# Altium project Ad_Hoc_Node.PrjPCB
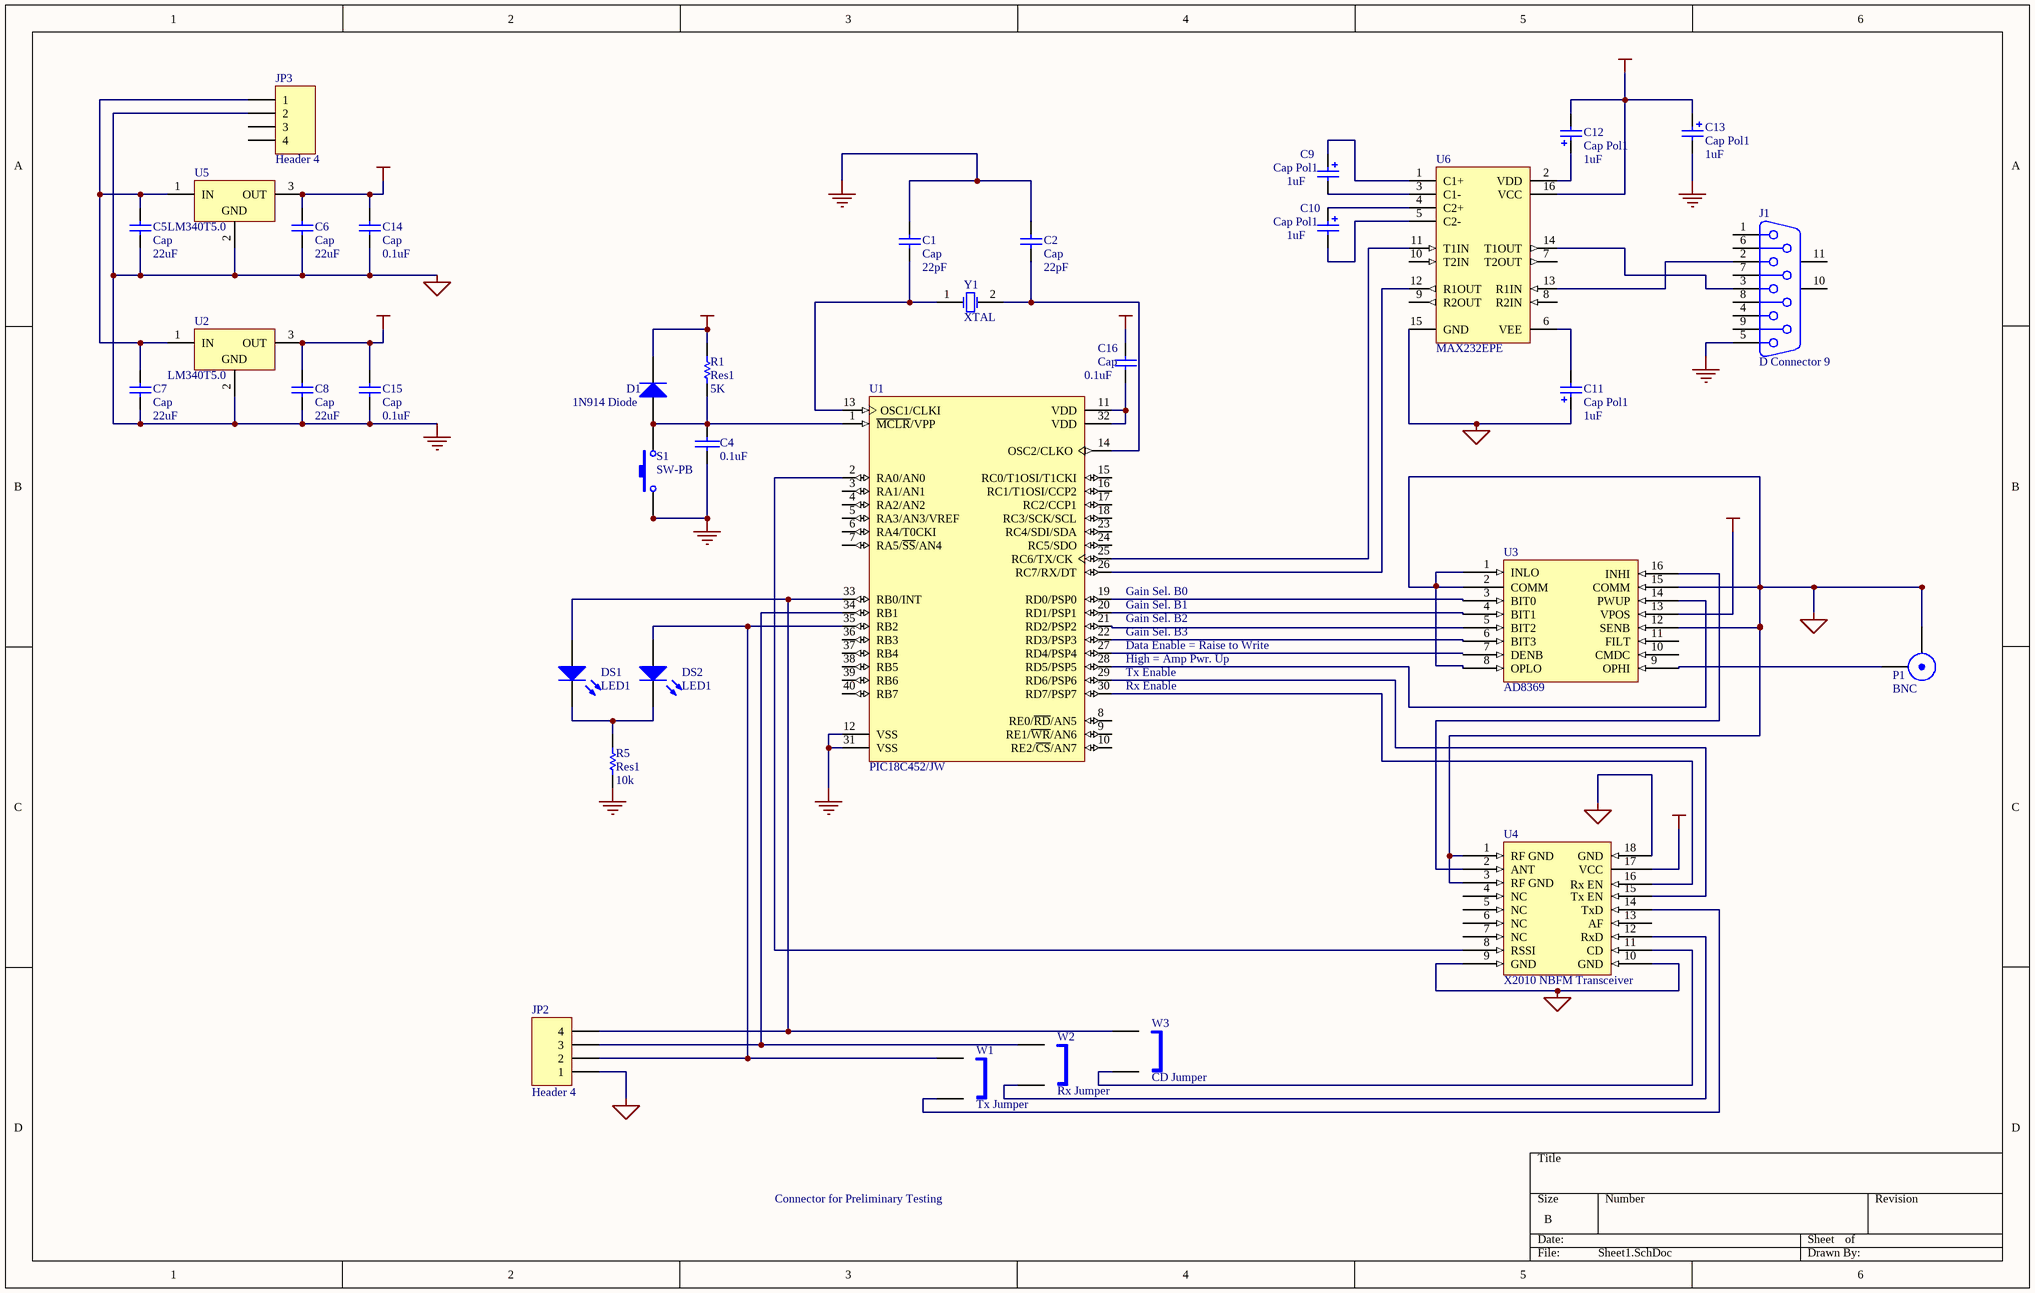
[diagram p0: Sheet1.SchDoc]
2 sheets, 44 parts. Net scope: global (net labels, ports and power ports of the same name join across sheets).
Board files: Ad Hoc Node PCB_A.PcbDoc, TSSOP_Adapt.PcbDoc
Sheets:
  Sheet1.SchDoc
  Sheet2.SchDoc

## Sheet Sheet1.SchDoc
size B

### Parts
(Parts that share a designator on the sheet are numbered #1, #2 ... from top to bottom, then left to right.)
C1  Cap  value 22pF  [5.6mm Ceramic Cap]
C2  Cap  value 22pF  [5.6mm Ceramic Cap]
C4#1  0.1uF  [5mm Tant. Cap]
C5#1  Cap  value 22uF  [2mm Pol. Cap]
C6  Cap  value 22uF  [2mm Pol. Cap]
C7  Cap  value 22uF  [2mm Pol. Cap]
C8  Cap  value 22uF  [2mm Pol. Cap]
C9  Cap Pol1  value 1uF  [2mm Pol. Cap]
C10  Cap Pol1  value 1uF  [2mm Pol. Cap]
C11  Cap Pol1  value 1uF  [2mm Pol. Cap]
C12  Cap Pol1  value 1uF  [2mm Pol. Cap]
C13  Cap Pol1  value 1uF  [2mm Pol. Cap]
C14  Cap  value 0.1uF  [5mm Tant. Cap]
C15  Cap  value 0.1uF  [5mm Tant. Cap]
C16  Cap  value 0.1uF  [5mm Tant. Cap]
D1#1  1N914 Diode  [DIO7.1-3.9X1.9]
DS1  LED1  [LED]
DS2  LED1  [LED]
J1  D Connector 9  [DSUB1.385-2H9]
JP2  Header 4  [4 Way Terminal Block]
JP3  Header 4  [4 Way Terminal Block]
P1  BNC  [PCB BNC Connector - duplicate]
R1#1  Res1  value 5K  [AXIAL-0.3]
R5  Res1  value 10k  [AXIAL-0.3]
S1  SW-PB  [Reset Switch - duplicate]
U1  PIC18C452/JW  [PIC18C452_PLCC - duplicate]
U2#1  LM340T5.0  [SFM-T3/A4.7V]
U3  AD8369  [24 pin DIP socket for TSSOP]
U4  X2010 NBFM Transceiver  [X2010]
U5  LM340T5.0  [SFM-T3/A4.7V]
U6  MAX232EPE  [DIP-16/X1.5]
W1  Tx Jumper  [RAD-0.1]
W2  Rx Jumper  [RAD-0.1]
W3  CD Jumper  [RAD-0.1]
Y1  XTAL  [XTAL]

### Nets
GND: C1.2 C2.2 C4#1.2 C5#1.2 C6.2 C7.2 C8.2 C11.1 C13.2 C14.2 C15.2 J1.5 JP2.1 JP3.2 P1.2(Y) R5.2 S1.1 U1.12(VSS) U1.31(VSS) U2#1.2(GND) U3.12(SENB) U3.15(COMM) U4.1(RF_GND) U4.3(RF_GND) U4.9(GND) U4.10(GND) U4.18(GND) U5.2(GND) U6.15(GND)  [also labelled SGND]
VCC: C6.1 C12.2 C13.1 C14.1 D1#1.2(K) R1#1.2 U3.13(VPOS) U4.17(VCC) U5.3(OUT) U6.16(VCC)
VDD: C8.1 C15.1 C16.1 U2#1.3(OUT)
NetC1_1: C1.1 U1.13(OSC1/CLKI) Y1.1(OSC1)
NetC2_1: C2.1 U1.14(OSC2/CLKO) Y1.2(OSC2)
NetC4#1_1: C4#1.1 D1#1.1(A) R1#1.1 S1.2 U1.1(~{MCLR}/VPP)
NetC5#1_1: C5#1.1 C7.1 JP3.1 U2#1.1(IN) U5.1(IN)
NetC9_1: C9.1 U6.1(C1+)
NetC9_2: C9.2 U6.3(C1-)
NetC10_1: C10.1 U6.4(C2+)
NetC10_2: C10.2 U6.5(C2-)
NetC11_2: C11.2 U6.6(VEE)
NetC12_1: C12.1 U6.2(VDD)
NetC16_2: C16.2 U1.11(VDD) U1.32(VDD)
NetDS1_1: DS1.1(A) JP2.4 U1.33(RB0/INT) W3.1
NetDS1_2: DS1.2(K) DS2.2(K) R5.1
NetDS2_1: DS2.1(A) JP2.2 U1.35(RB2) W1.1
NetJ1_2: J1.2 U6.13(R1IN)
NetJ1_3: J1.3 U6.14(T1OUT)
NetJP2_3: JP2.3 U1.34(RB1) W2.1
NetP1_1: P1.1(X) U3.9(OPHI)
NetU1_2: U1.2(RA0/AN0) U4.8(RSSI)
NetU1_19: U1.19(RD0/PSP0) U3.3(BIT0)
NetU1_20: U1.20(RD1/PSP1) U3.4(BIT1)
NetU1_21: U1.21(RD2/PSP2) U3.5(BIT2)
NetU1_22: U1.22(RD3/PSP3) U3.6(BIT3)
NetU1_25: U1.25(RC6/TX/CK) U6.11(T1IN)
NetU1_26: U1.26(RC7/RX/DT) U6.12(R1OUT)
NetU1_28: U1.28(RD5/PSP5) U3.14(PWUP)
NetU1_29: U1.29(RD6/PSP6) U4.15(Tx_EN)
NetU1_30: U1.30(RD7/PSP7) U4.16(Rx_EN)
NetU3_1: U3.1(INLO) U3.8(OPLO)
NetU3_16: U3.16(INHI) U4.2(ANT)
NetU4_11: U4.11(CD) W3.2
NetU4_12: U4.12(RxD) W2.2
NetU4_14: U4.14(TxD) W1.2

Not connected (* = marked no-connect by the designer): J1 1 4 6 7 8 9 10(MH1) 11(MH2); JP3 3 4; U1 3(RA1/AN1) 4(RA2/AN2) 5(RA3/AN3/VREF) 6(RA4/T0CKI) 7(RA5/~{SS}/AN4) 8(RE0/~{RD}/AN5) 9(RE1/~{WR}/AN6) 10(RE2/~{CS}/AN7) 15(RC0/T1OSI/T1CKI) 16(RC1/T1OSI/CCP2) 17(RC2/CCP1) 18(RC3/SCK/SCL) 23(RC4/SDI/SDA) 24(RC5/SDO) 27(RD4/PSP4) 36(RB3) 37(RB4) 38(RB5) 39(RB6) 40(RB7); U3 2(COMM) 7(DENB) 10(CMDC) 11(FILT); U4 4(NC) 5(NC) 6(NC) 7(NC) 13(AF); U6 7(T2OUT) 8(R2IN) 9(R2OUT) 10(T2IN)

### Notes on the sheet
- (near U1) Gain Sel. B3
- (near U1) Gain Sel. B2
- (near U1) Gain Sel. B1
- (near U1) Gain Sel. B0
- (near U1) Rx Enable
- (near U1) Tx Enable
- (near U1) High = Amp Pwr. Up
- (near U1) Data Enable = Raise to Write
- Connector for Preliminary Testing

### Library data of the parts
C1 C2 C5#1 C6-C8 C14-C16 = Cap: Capacitor; Manufacturer: Generic Components; Class I: Passive; Published: 8-Jun-2000; Revision: July-2002: Re-released for DXP Platform.; Publisher: Altium Limited; Class II: Capacitor
C4#1 = CAP: Capacitor
C9-C13 = Cap Pol1: Polarized Capacitor (Radial); Manufacturer: Generic Components; Class I: Passive; Published: 8-Jun-2000; Revision: July-2002: Re-released for DXP Platform.; Publisher: Altium Limited; Class II: Capacitor
D1#1 = Diode: Default Diode; Manufacturer: Generic Components; Class I: Discrete; Class II: Diode - Switching; Published: 8-Jun-2000; Revision: July-2002: Re-released for DXP Platform.; Publisher: Altium Limited
DS1 DS2 = LED1: Typical RED GaAs LED; Manufacturer: Generic Components; Class I: Optoelectronic; Published: 8-Jun-2000; Revision: July-2002: Re-released for DXP Platform.; Publisher: Altium Limited; Class II: LED
J1 = D Connector 9: Receptacle Assembly, 9 Position, Right Angle; Manufacturer: Generic Components; Package Information: Latest Revision: O; Positions: 9; Published: 15-Jun-2001; Revision: July-2002: Re-released for DXP Platform.; Datasheet: (1-Sep-1999); Package Reference: 788750; Publisher: Altium Limited; Class I: Connector; Orientation: Right Angle; Gender: Receptacle
JP2 JP3 = Header 4: Header, 4-Pin; Manufacturer: Generic Components; Class I: Connector; Revision: July-2002: Re-released for DXP Platform.; Publisher: Altium Limited
P1 = BNC: BNC Elbow Connector; Manufacturer: Generic Components; Class II: RF Coaxial; Revision: July-2002: Re-released for DXP Platform.; Publisher: Altium Limited; Class I: Connector
R1#1 R5 = Res1: Resistor; Manufacturer: Generic Components; Class I: Passive; Published: 8-Jun-2000; Revision: July-2002: Re-released for DXP Platform.; Publisher: Altium Limited; Class II: Resistor
S1 = SW-PB: Switch; Manufacturer: Generic Components; Published: 24-Mar-1999; Revision: July-2002: Re-released for DXP Platform.; Publisher: Altium Limited
U1 = PIC16C74I/JW: EPROM-Based 8-Bit CMOS Microcontroller with A/D Converter; Manufacturer: Microchip; Published: 8-Jun-2000; Revision: July-2002: Re-released for DXP Platform.; Datasheet: Latest Revision: 1997; Package Reference: JW40; Publisher: Altium Limited; Class I: Microcontroller; Class II: 8-bit
U2#1 U5 = LM340T5.0: Series 3-Terminal Positive Regulator; Manufacturer: National Semiconductor; Package Information: Latest Revision: 1995; Class I: Power Management; Class II: Voltage Regulator; Note: Tab is connected to GND; Published: 15-Apr-2002; Datasheet: Latest Revision: Jan-1995; Package Reference: T03B; Publisher: Altium Limited
U3 = AD8369_DIGITAL_CONT_PWR_AMP
U4 = NBFM_TRANSCEIVER
U6 = MAX232EPE: +5V Powered RS-232 Driver/Receiver; Manufacturer: Maxim; Class I: Communication; Class II: Transceiver; Published: 16-Jan-2001; Revision: July-2002: Re-released for DXP Platform.; Datasheet: Latest Revision: Apr-1992; Package Reference: PE16A; Publisher: Altium Limited
W1-W3 = Jumper: Jumper Wire; Manufacturer: Generic Components; Published: 24-Mar-1999; Revision: July-2002: Re-released for DXP Platform.; Publisher: Altium Limited
Y1 = XTAL: Crystal Oscillator; Manufacturer: Generic Components; Published: 8-Jun-2000; Revision: July-2002: Re-released for DXP Platform.; Publisher: Altium Limited; Class I: Oscillator; Class II: Crystal Oscillator

## Sheet Sheet2.SchDoc
size B
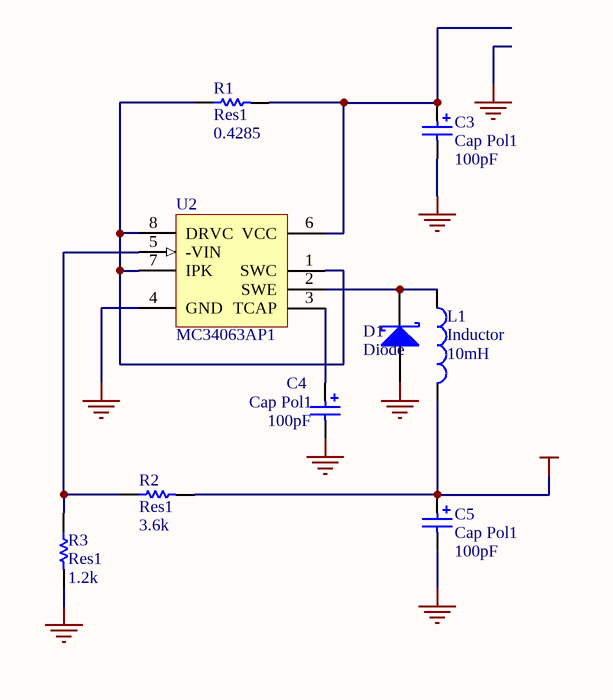
[diagram p1: Sheet2.SchDoc]

### Parts
(Parts that share a designator on the sheet are numbered #1, #2 ... from top to bottom, then left to right.)
C3  Cap Pol1  value 100pF  [RB7.6-15]
C4#2  Cap Pol1  value 100pF  [RB7.6-15]
C5#2  Cap Pol1  value 100pF  [RB7.6-15]
D1#2  Diode  [DSO-C2/X2.3]
L1  Inductor  value 10mH  [C1005-0402]
R1#2  Res1  value 0.4285  [AXIAL-0.3]
R2  Res1  value 3.6k  [AXIAL-0.3]
R3  Res1  value 1.2k  [AXIAL-0.3]
U2#2  MC34063AP1  [DIP-8]

### Nets
GND: C3.2 C4#2.2 C5#2.2 D1#2.1(A) R3.2 U2#2.4(GND)
VCC: C5#2.1 L1.2 R2.2
NetC3_1: C3.1 R1#2.2 U2#2.6(VCC)
NetC4#2_1: C4#2.1 U2#2.3(TCAP)
NetD1#2_2: D1#2.2(K) L1.1 U2#2.2(SWE)
NetR1#2_1: R1#2.1 U2#2.1(SWC) U2#2.7(IPK) U2#2.8(DRVC)
NetR2_1: R2.1 R3.1 U2#2.5(-VIN)

### Library data of the parts
C3 C4#2 C5#2 = Cap Pol1: as C9 on sheet Sheet1; Published: 8-Jun-2000; Revision: July-2002: Re-released for DXP Platform.; Publisher: Altium Limited; Class II: Capacitor
D1#2 = D Schottky: Schottky Diode; Manufacturer: Generic Components; Class I: Discrete; Class II: Diode - Schottky; Published: 8-Jun-2000; Revision: July-2002: Re-released for DXP Platform.; Publisher: Altium Limited
L1 = Inductor: Manufacturer: Generic Components; Class I: Passive; Published: 8-Jun-2000; Revision: July-2002: Re-released for DXP Platform.; Publisher: Altium Limited; Class II: Inductor
R1#2 R2 R3 = Res1: as R1#1 on sheet Sheet1; Published: 8-Jun-2000; Revision: July-2002: Re-released for DXP Platform.; Publisher: Altium Limited; Class II: Resistor
U2#2 = MC34063AP1: DC-to-DC Converter Control Circuit; Manufacturer: Motorola; Class I: Power Management; Class II: DC-DC Converter; Published: 15-Apr-2002; Datasheet: Linear and Interface Integrated Circuits, DL128 Rev2 (1988); Package Reference: 626-05; Publisher: Altium Limited

## Nets that join several sheets
GND: Sheet1 (29 pins), Sheet2 (6 pins)
VCC: Sheet1 (10 pins), Sheet2 (C5#2.1 L1.2 R2.2)